# EAGLE design Power_IR2153 (EAGLE 7.3.0)
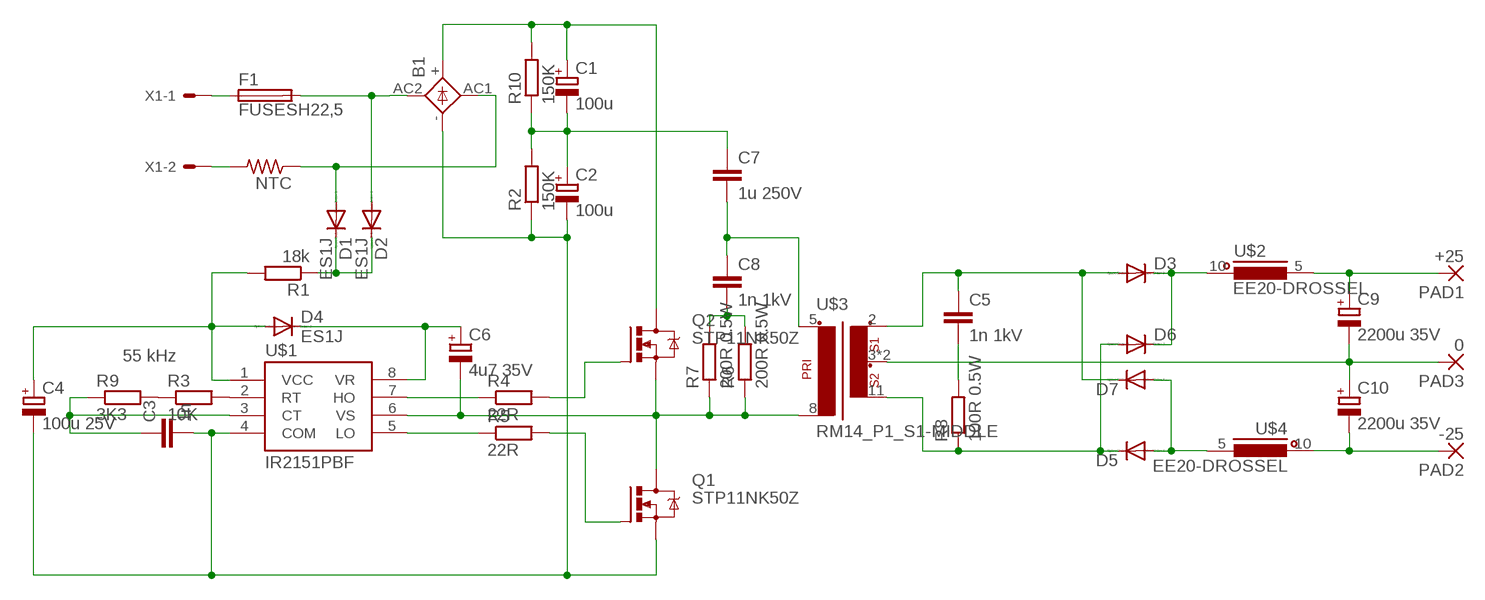
[diagram p0: schematic, sheet 1]

## Parts
B1  KBL  [KBL]
C1  100u  CPOL-EUE10-22.5  [EB22,5D]
C2  100u  CPOL-EUE10-22.5  [EB22,5D]
C3  1n  C-EUC1206  [C1206]
C4  100u 25V  CPOL-EUE2.5-7  [E2,5-7]
C5  1n 1kV  C-EU050-025X075  [C050-025X075]
C6  4u7 35V  CPOL-EUE2.5-5  [E2,5-5]
C7  1u 250V  C-EU225-074X268  [C225-074X268]
C8  1n 1kV  C-EU050-025X075  [C050-025X075]
C9  2200u 35V  CPOL-EUE7.5-16  [E7,5-16]
C10  2200u 35V  CPOL-EUE7.5-16  [E7,5-16]
D1  ES1J  DIODE-DO-214AC  [DO-214AC]
D2  ES1J  DIODE-DO-214AC  [DO-214AC]
D3  DIODE-SMB  [SMB]
D4  ES1J  DIODE-DO-214AC  [DO-214AC]
D5  DIODE-SMB  [SMB]
D6  DIODE-SMB  [SMB]
D7  DIODE-SMB  [SMB]
F1  FUSESH22,5  SH22,5  [SH22,5]
NTC  R-US_0207/10  [0207/10]
PAD1  +25  2,54/0,8  [2,54/0,8]
PAD2  -25  2,54/0,8  [2,54/0,8]
PAD3  0  2,54/0,8  [2,54/0,8]
Q1  STP11NK50Z  IRF740  [TO220BV]
Q2  STP11NK50Z  IRF740  [TO220BV]
R1  18k  R-EU_0922/22  [0922/22]
R2  150K  R-EU_0207/10  [0207/10]
R3  10K  R-EU_R1206  [R1206]
R4  22R  R-EU_R1206  [R1206]
R5  22R  R-EU_R1206  [R1206]
R6  200R 0.5W  R-EU_0207/10  [0207/10]
R7  200R 0.5W  R-EU_0207/10  [0207/10]
R8  100R 0.5W  R-EU_0207/10  [0207/10]
R9  3K3  R-EU_R1206  [R1206]
R10  150K  R-EU_0207/10  [0207/10]
U$1  IR2151PBF  [DIP-8]
U$2  EE20-DROSSEL  [EE20_DROSSEL]
U$3  RM14_P1_S1-MIDDLE  [RM14]
U$4  EE20-DROSSEL  [EE20_DROSSEL]
X1  KK-156-2  [KK-156-2]

## Nets
COM: B1.- C2.- C3.2 C4.- Q1.S R2.1 U$1.4(COM)
CT: C3.1 R9.1 U$1.3(CT)
HO: R4.1 U$1.7(HO)
LO: R5.1 U$1.5(LO)
N$1: NTC.2 X1.2
N$2: F1.1 X1.1
N$3: B1.AC1(AC2) D1.A NTC.1
N$4: B1.AC2(AC1) D2.A F1.2
N$5: C8.2 R6.2 R7.2
N$6: B1.+ C1.+ Q2.D R10.2
N$7: C5.2 R8.2
N$8: C7.2 C8.1 U$3.5(P1-1)
N$9: C1.- C2.+ C7.1 R2.2 R10.1
N$10: D1.C D2.C R1.1
N$11: C5.1 D3.A D7.C U$3.2(S1)
N$12: D5.C D6.A R8.1 U$3.11(S2)
N$13: Q1.G R5.2
N$14: Q2.G R4.2
N$15: D5.A D7.A U$4.5
N$16: D3.C D6.C U$2.10
N$17: C9.- C10.+ PAD3.1(P) U$3.3(SM) U$3.10(SM)
N$18: C9.+ PAD1.1(P) U$2.5
N$19: R3.1 R9.2
N$20: C10.- PAD2.1(P) U$4.10
RT: R3.2 U$1.2(RT)
VCC: C4.+ D4.A R1.2 U$1.1(VCC)
VR: C6.+ D4.C U$1.8(VR)
VS: C6.- Q1.D Q2.S R6.1 R7.1 U$1.6(VS) U$3.8(P1-2)

## Notes on the sheet
- 55 kHz

## Library data of the parts
B1 = rectifier:KBL: DIOTEC RECTIFIER
C1 C2 C4 C6 C9 C10 = rcl:CPOL-EU: POLARIZED CAPACITOR, European symbol
C3 C5 C7 C8 = rcl:C-EU: CAPACITOR, European symbol
D1-D7 = diode:DIODE-: DIODE
F1 = fuse:SH22,5: FUSE HOLDER grid 22,5 mm, OGN0031 8201, Schurter (Buerklin); MF: SCHURTER; MPN: 0031.8201; OC_FARNELL: 1162740; OC_NEWARK: 96F8317
NTC = rcl:R-US_: RESISTOR, American symbol
PAD1-PAD3 = wirepad:2,54/0,8: THROUGH-HOLE PAD
Q1 Q2 = transistor-power:IRF740: N-CHANNEL MOS FET
R1-R10 = rcl:R-EU_: RESISTOR, European symbol
U$1 = untitled:IR2151PBF
U$2 U$4 = _Transformers:EE20-DROSSEL
U$3 = _Transformers:RM14_P1_S1-MIDDLE
X1 = con-molex:KK-156-2: KK 156 HEADER Source: http://www.molex.com/pdm_docs/sd/026604100_sd.pdf; OC_FARNELL: unknown; OC_NEWARK: unknown

## Board
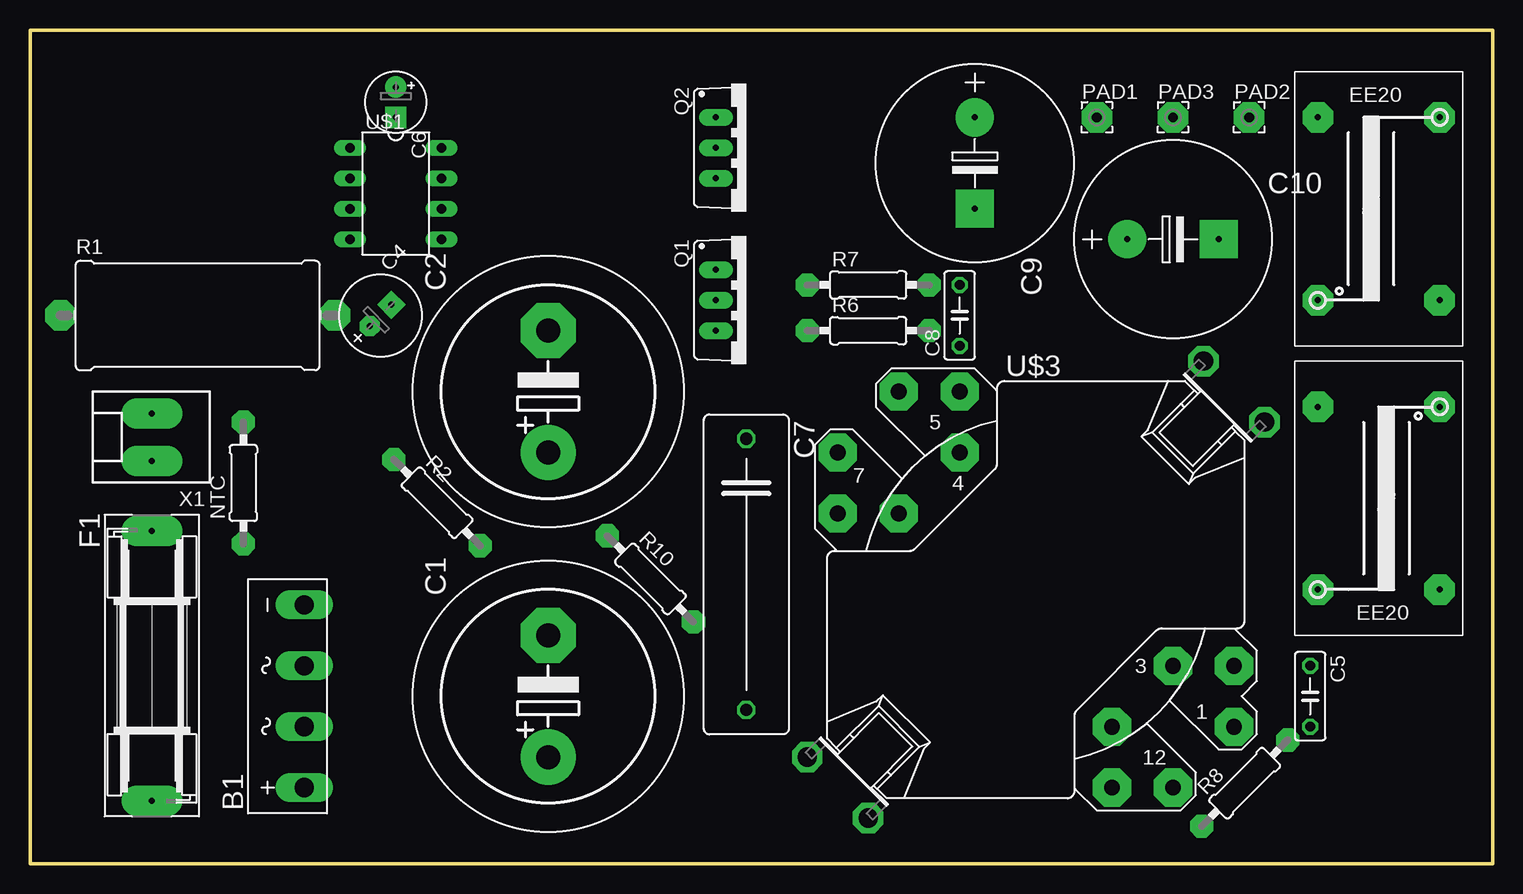
[diagram p1: board, top side]
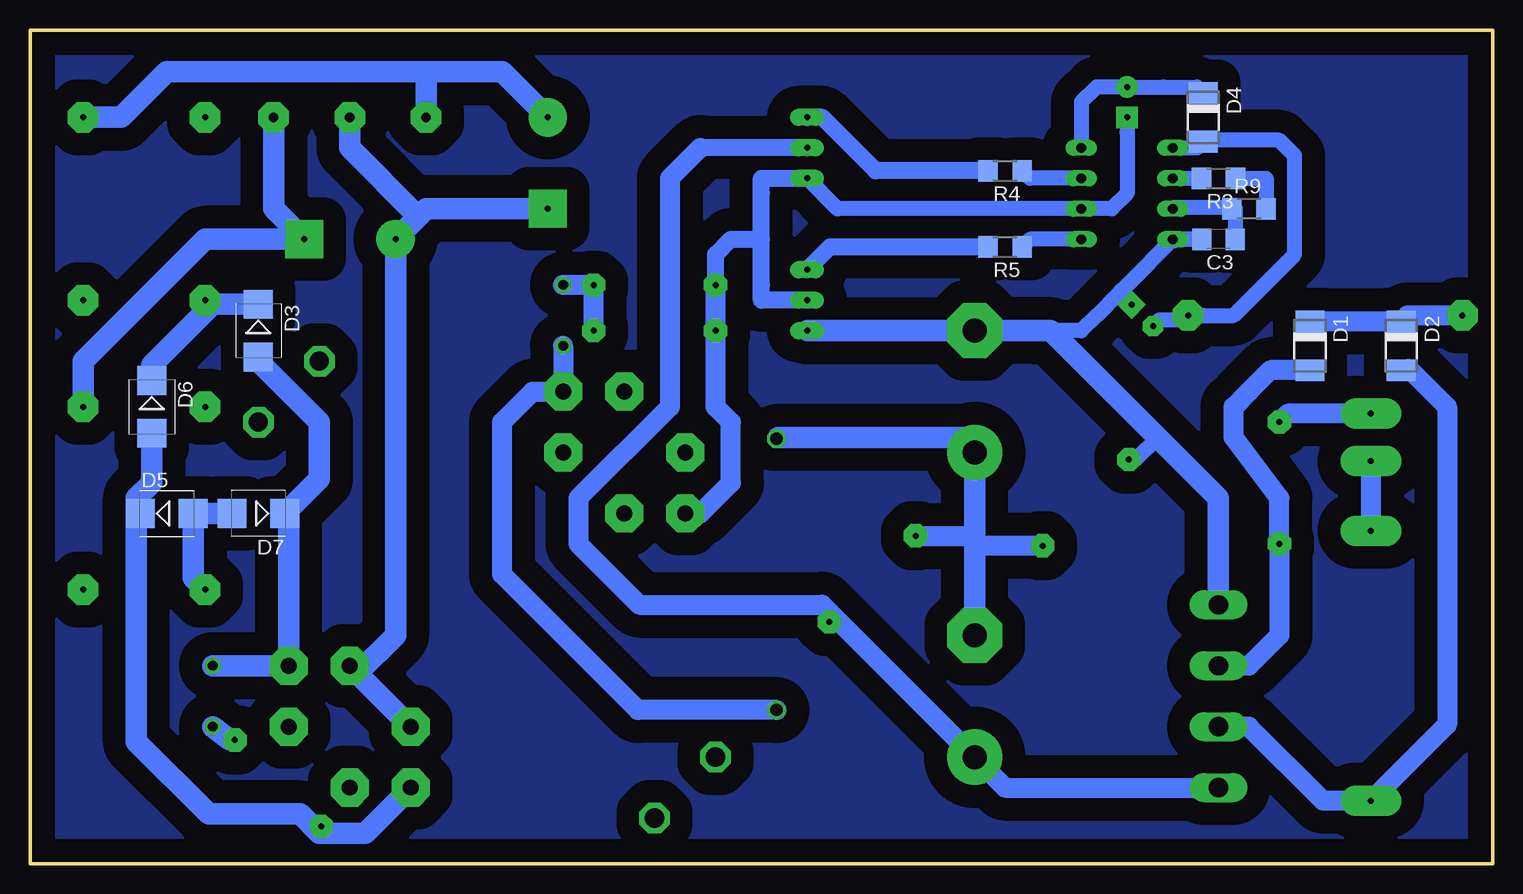
[diagram p2: board, bottom side, seen from below]

Size 121.9 x 69.52 mm. Coordinates in mm from the lower left corner, seen from the top.
Outline: 0,0 121.9,0 121.9,69.52 0,69.52 0,0
Copper layers (1*16): Top 0.035mm / dielectric 1.5mm / Bottom 0.035mm
Design rules "default": minimum track width 10mil, minimum drill 24mil, track to track 8mil, track to pad 8mil, pad to pad 8mil, via to via 8mil, smd to smd 8mil, copper to edge 40mil, drill to drill 8mil, minimum pad ring 10mil, minimum via ring 8mil, stop-mask expansion 4mil, vias tented up to drill 0mil, thermal gap 10mil

### Footprints (pad centres in the part's own frame; a part is rotated, then mirrored left to right if it is on the bottom)
KBL = drill 1.6 long: + -7.62,-1.27; - 7.62,-1.27; AC1 2.54,-1.27; AC2 -2.54,-1.27
EB22,5D = drill 2.007 pad 4.597: + -5.08,0 | drill 2.007 pad 4.597 octagon: - 5.08,0
C1206 = smd 1.6 x 1.8: 1 -1.4,0; 2 1.4,0
E2,5-7 = drill 0.5 pad 1.676 octagon: + -1.27,0 | drill 0.5 pad 1.676 square: - 1.27,0
C050-025X075 = drill 0.813 octagon: 1 -2.54,0; 2 2.54,0
E2,5-5 = drill 0.5 pad 1.778: + -1.27,0 | drill 0.5 pad 1.778 square: - 1.27,0
C225-074X268 = drill 1.016 octagon: 1 -11.303,0; 2 11.303,0
E7,5-16 = drill 0.5 pad 3.175: + -3.81,0 | drill 0.5 pad 3.175 square: - 3.81,0
DO-214AC = smd 1.8 x 2.4: A 2.025,0; C -2.025,0
SMB = smd 2.4 x 2.4: A 2.2,0; C -2.2,0
SH22,5 = drill 0.5 pad 2.54 long: 1 -11.252,0; 2 11.252,0
0207/10 = drill 0.5 pad 1.93 octagon: 1 -5.08,0; 2 5.08,0
2,54/0,8 = drill 0.813 pad 2.54 octagon: 1 0,0
TO220BV = drill 0.5 pad 1.422 long: D 0,-2.54; G -2.54,-2.54; S 2.54,-2.54
0922/22 = drill 0.5 pad 2.54 octagon: 1 -11.43,0; 2 11.43,0
R1206 = smd 1.6 x 1.803: 1 -1.422,0; 2 1.422,0
DIP-8 = drill 0.813 long: 1 -3.81,-3.81; 2 -1.27,-3.81; 3 1.27,-3.81; 4 3.81,-3.81; 5 3.81,3.81; 6 1.27,3.81; 7 -1.27,3.81; 8 -3.81,3.81
EE20_DROSSEL = drill 0.5 pad 2.54 octagon: 1 -7.62,-5.715; 5 7.62,-5.715; 6 7.62,4.445; 10 -7.62,4.445
RM14 = drill 1.321 pad 3.175 octagon: 1 16.51,-11.43; 2 16.51,-6.35; 3 11.43,-6.35; 4 -6.35,11.43; 5 -6.35,16.51; 6 -11.43,16.51; 7 -16.51,11.43; 8 -16.51,6.35; 9 -11.43,6.35; 10 6.35,-11.43; 11 6.35,-16.51; 12 11.43,-16.51 | drill 1.6 pad 2.54 octagon: M -19.05,-13.97; M1 -13.97,-19.05; M2 13.97,19.05; M3 19.05,13.97
KK-156-2 = drill 0.5 pad 2.54 long: 1 -1.98,0; 2 1.98,0

### Placement (x,y rotation side)
B1  21.59,13.97 90 top
C1  43.18,13.97 90 top
C2  43.18,39.37 90 top
C3  22.86,52.07 180 bottom
C4  29.21,45.72 45 top
C5  106.68,13.97 270 top
C6  30.48,63.5 270 top
C7  59.69,24.13 270 top
C8  77.47,45.72 90 top
C9  78.74,58.42 270 top
C10  95.25,52.07 0 top
D1  15.24,43.18 270 bottom
D2  7.62,43.18 270 bottom
D3  102.87,44.45 270 bottom
D4  24.13,62.23 270 bottom
D5  110.49,29.21 0 bottom
D6  111.76,38.1 270 bottom
D7  102.87,29.21 180 bottom
F1  10.16,16.51 270 top
NTC  17.78,31.75 90 top
PAD1  88.9,62.23 0 top
PAD2  101.6,62.23 0 top
PAD3  95.25,62.23 0 top
Q1  59.69,46.99 270 top
Q2  59.69,59.69 270 top
R1  13.97,45.72 0 top
R2  33.92,30.11 315 top
R3  22.86,57.15 180 bottom
R4  40.64,57.79 180 bottom
R5  40.64,51.44 180 bottom
R6  69.85,44.45 0 top
R7  69.85,48.26 0 top
R8  101.23,6.72 45 top
R9  20.32,54.61 0 bottom
R10  51.7,23.76 315 top
U$1  30.48,55.88 270 top
U$2  111.76,54.61 90 top
U$3  83.82,22.86 0 top
U$4  113.03,30.48 270 top
X1  10.16,35.56 90 top

### Tracks (layer width: path | path; a pad name or v marks a point on that pad's centre or on a via)
COM
  Bottom 0.813: 27.94,35.56 30.48,38.1 | 26.54,51.94 U$1.4
  Bottom 1.27: C3.2 26.54,51.94 | U$1.4 24.13,52.07 U$1.4 | U$1.4 30.48,48.26 31.11,47.62 | 38.1,44.45 34.29,44.45 33.02,45.72 31.11,47.62 | R2.1 29.8,33.7 27.94,35.56 | C4.- 31.11,47.62
  Bottom 1.778: B1.- 22.86,30.48 27.94,35.56 30.48,38.1 31.11,38.74 34.29,41.91 36.83,44.45 38.1,44.45 C2.- 44.45,44.45 Q1.S
CT
  Bottom 0.813: 26.54,54.74 U$1.3
  Bottom 1.27: C3.1 21.46,54.61 R9.1 21.74,54.74 26.54,54.74
HO
  Bottom 1.27: U$1.7 38.58,57.15 R4.1
LO
  Bottom 1.27: U$1.5 38.58,52.07 R5.1
N$1
  Bottom 1.676: X1.2 17.07,37.54 NTC.2
N$2
  Bottom 1.676: X1.1 F1.1
N$3
  Bottom 1.676: B1.AC1 20.32,16.51 17.78,19.05 NTC.1 17.78,30.48 21.59,35.56 21.59,38.1 20.32,39.37 18.54,41.16 D1.A
N$4
  Bottom 1.676: B1.AC2 20.32,11.43 14.15,5.26 F1.2 3.81,11.61 3.81,38.1 6.99,41.28 D2.A
N$5
  Bottom 1.676: R6.2 R7.2 C8.2
N$6
  Bottom 1.422: Q2.D 66.04,59.69
  Bottom 1.676: 66.04,59.69 68.58,57.15 68.58,53.34 68.58,38.1 76.2,30.48 76.2,26.67 71.12,21.59 55.88,21.59 55.24,20.95 | 55.24,20.95 C1.+ 40.64,6.35 B1.+ | R10.2 55.24,20.17 55.24,20.95
N$7
  Bottom 1.778: R8.2 105.26,10.31 C5.2
N$8
  Bottom 1.676: C8.1 U$3.5 80.01,39.37 82.55,36.83 82.55,24.13 71.25,12.83 C7.2
N$9
  Bottom 0.813: 59.56,35.56 C7.1
  Bottom 1.676: R2.2 43.18,26.52 43.18,26.67 43.18,27.35 R10.1
  Bottom 1.778: C1.- 43.18,26.67 C2.+ 43.18,35.56 59.56,35.56
N$10
  Bottom 1.676: R1.1 7.11,45.72 D2.C D1.C
N$11
  Bottom 1.778: C5.1 U$3.2 100.33,28.87 D7.C 97.79,32.09 97.79,36.83 102.87,41.91 D3.A
N$12
  Bottom 0.813: R8.1 97.79,2.54 99.06,3.81
  Bottom 1.778: U$3.11 93.98,2.54 97.79,2.54 99.4,4.15 107.02,4.15 113.03,10.16 113.03,30.48 | 113.03,30.48 D5.C | D6.A 111.76,31.75 113.03,30.48
N$13
  Bottom 1.422: R5.2 55.24,51.44 Q1.G
N$14
  Bottom 1.422: R4.2 51.44,57.79 55.88,62.23 Q2.G
N$15
  Bottom 1.778: D7.A D5.A 108.29,23.84 U$4.5
N$16
  Bottom 1.778: 107.66,46.65 U$2.10 106.97,46.65 106.68,46.65 | D3.C 106.68,46.65 | D6.C 111.76,41.57 106.68,46.65
N$17
  Bottom 1.778: U$3.10 94.61,15.88 | 94.61,15.88 U$3.3 | C9.- 88.9,54.61 89.53,53.98 | 89.53,53.98 C10.+ 91.44,19.05 94.61,15.88 | PAD3.1 95.25,59.69 89.53,53.98
N$18
  Bottom 1.778: U$2.5 114.3,62.23 110.49,66.04 88.9,66.04 | 88.9,66.04 82.55,66.04 C9.+ | PAD1.1 88.9,66.04
N$19
  Bottom 1.27: R3.1 18.9,57.15 R9.2
N$20
  Bottom 1.778: U$4.10 117.47,41.91 107.31,52.07 C10.- 101.6,54.61 PAD2.1
N$21
  pour Bottom (isolate 1.905): 0,69.85 121.92,69.85 121.92,0 0,0
RT
  Bottom 1.27: U$1.2 R3.2
VCC
  Bottom 1.27: 24.13,45.72 R1.2 21.59,45.72 16.51,50.8 16.51,59.05 17.78,60.33 24.01,60.33 D4.A 24.64,59.69 U$1.1 | 25.77,45.35 27.79,45.35 C4.+
  Bottom 1.422: 25.77,45.35 R1.2
VR
  Bottom 1.27: U$1.8 34.29,63.5 33.02,64.77 C6.+ 27.43,64.77 24.64,64.77 D4.C
VS
  Bottom 1.27: C6.- 30.48,60.96 30.48,55.88 31.75,54.61 U$1.6 54.61,54.61 Q2.S
  Bottom 1.422: Q1.D 60.96,46.99 60.96,48.26 60.96,52.07 | 60.96,52.07 60.96,55.88 60.96,57.15 Q2.S | R7.1 64.77,50.8 63.5,52.07 60.96,52.07
  Bottom 1.676: U$3.8 66.04,29.21 63.5,31.75 63.5,36.83 64.77,38.1 R6.1 R7.1